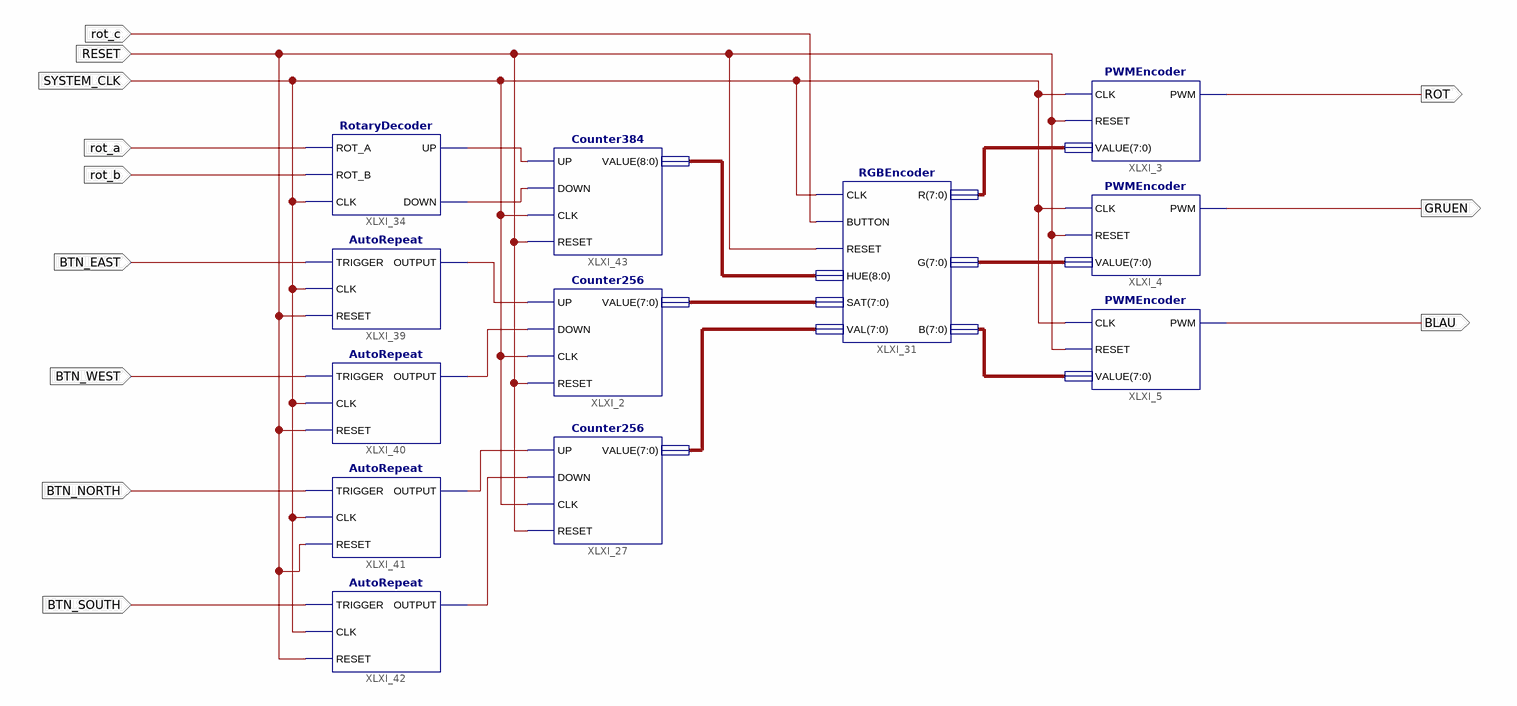
[diagram p0: schematic sheet 1]
// Xilinx ISE schematic Top_schematic.sch (spartan3e) as structural Verilog: 12 symbols, 12 ports
module Top_schematic (
  input  RESET,
  input  rot_c,
  input  SYSTEM_CLK,
  input  rot_a,
  input  rot_b,
  input  BTN_SOUTH,
  input  BTN_NORTH,
  input  BTN_WEST,
  input  BTN_EAST,
  output ROT,
  output GRUEN,
  output BLAU
);

  wire XLXN_17, XLXN_18, XLXN_118, XLXN_119, XLXN_124, XLXN_125;
  wire [7:0] XLXN_22, XLXN_23, XLXN_24, XLXN_77, XLXN_78;
  wire [8:0] XLXN_76;

  Counter256 XLXI_2 (.UP(XLXN_124), .DOWN(XLXN_118), .CLK(SYSTEM_CLK), .RESET(RESET), .VALUE(XLXN_78));
  Counter256 XLXI_27 (.UP(XLXN_125), .DOWN(XLXN_119), .CLK(SYSTEM_CLK), .RESET(RESET), .VALUE(XLXN_77));
  RGBEncoder XLXI_31 (
    .CLK(SYSTEM_CLK), .BUTTON(rot_c), .RESET(RESET), .HUE(XLXN_76), .SAT(XLXN_78), .VAL(XLXN_77),
    .R(XLXN_23), .G(XLXN_22), .B(XLXN_24));
  PWMEncoder XLXI_5 (.CLK(SYSTEM_CLK), .RESET(RESET), .VALUE(XLXN_24), .PWM(BLAU));
  PWMEncoder XLXI_4 (.CLK(SYSTEM_CLK), .RESET(RESET), .VALUE(XLXN_22), .PWM(GRUEN));
  PWMEncoder XLXI_3 (.CLK(SYSTEM_CLK), .RESET(RESET), .VALUE(XLXN_23), .PWM(ROT));
  RotaryDecoder XLXI_34 (.ROT_A(rot_a), .ROT_B(rot_b), .CLK(SYSTEM_CLK), .UP(XLXN_17), .DOWN(XLXN_18));
  AutoRepeat XLXI_42 (.TRIGGER(BTN_SOUTH), .CLK(SYSTEM_CLK), .RESET(RESET), .OUTPUT(XLXN_119));
  AutoRepeat XLXI_41 (.TRIGGER(BTN_NORTH), .CLK(SYSTEM_CLK), .RESET(RESET), .OUTPUT(XLXN_125));
  AutoRepeat XLXI_40 (.TRIGGER(BTN_WEST), .CLK(SYSTEM_CLK), .RESET(RESET), .OUTPUT(XLXN_118));
  AutoRepeat XLXI_39 (.TRIGGER(BTN_EAST), .CLK(SYSTEM_CLK), .RESET(RESET), .OUTPUT(XLXN_124));
  Counter384 XLXI_43 (.UP(XLXN_17), .DOWN(XLXN_18), .CLK(SYSTEM_CLK), .RESET(RESET), .VALUE(XLXN_76));
endmodule
